# Altium schematic sheet Schematic.SchDoc
size 420 x 297 mm; SheetNumber: 1; SheetTotal: 1
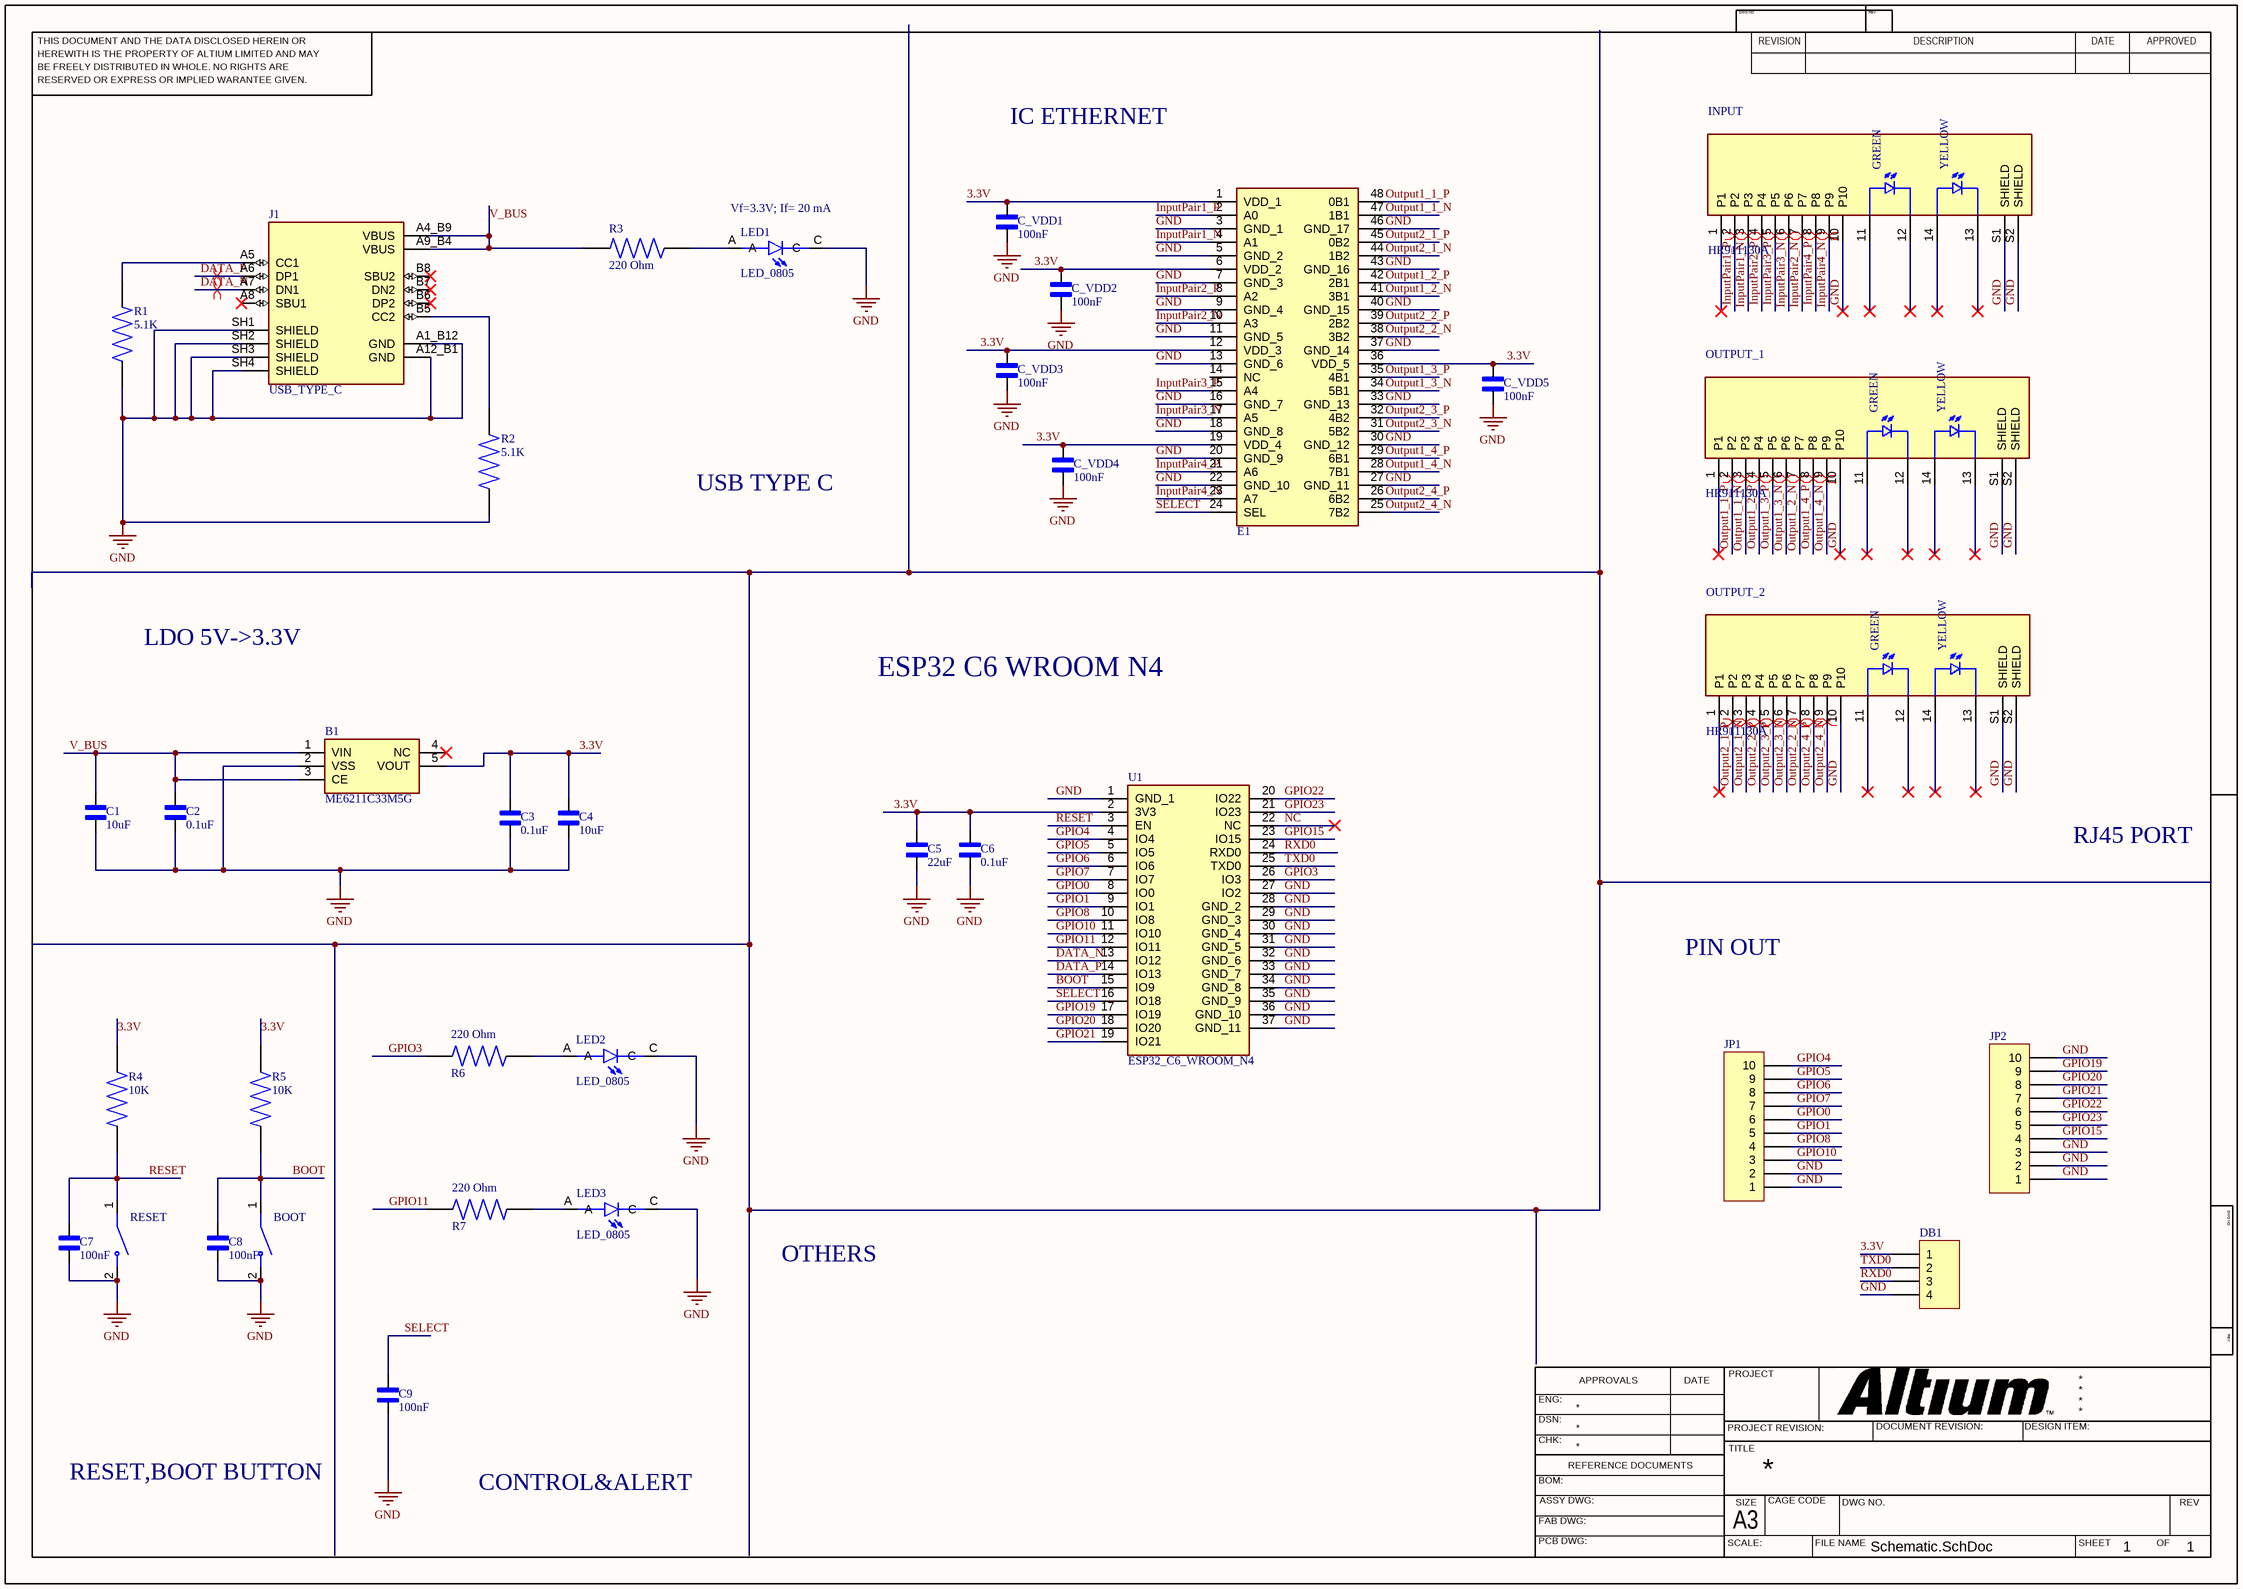
[diagram p0: Schematic.SchDoc]

## Parts
B1  ME6211C33M5G  [SOT95P282X145-5N]
BOOT  SW_B3U_P1000  [PCBComponent_1]  (value not drawn)
C1  10uF  [CAP 0.1UF_0805]
C2  0.1uF  [CAP 0.1UF_0805]
C3  0.1uF  [CAP 0.1UF_0805]
C4  10uF  [CAP 0.1UF_0805]
C5  22uF  [CAP 0.1UF_0805]
C6  0.1uF  [CAP 0.1UF_0805]
C7  100nF  [CAP 0.1UF_0805]
C8  100nF  [CAP 0.1UF_0805]
C9  100nF  [CAP 0.1UF_0805]
C_VDD1  100nF  [CAP 0.1UF_0805]
C_VDD2  100nF  [CAP 0.1UF_0805]
C_VDD3  100nF  [CAP 0.1UF_0805]
C_VDD4  100nF  [CAP 0.1UF_0805]
C_VDD5  100nF  [CAP 0.1UF_0805]
DB1  *Header  [HDR1X4]  (value not drawn)
E1  TS3L301  [TS3L301]  (value not drawn)
INPUT  HR911130A  [HR911130_A]
J1  USB_TYPE_C  [KINGHELM_KH-TYPE-C-16P]
JP1  *Header  [HDR1X10]  (value not drawn)
JP2  *Header  [HDR1X10]  (value not drawn)
LED1  LED_0805  [LED 0805]
LED2  LED_0805  [LED 0805]
LED3  LED_0805  [LED 0805]
OUTPUT_1  HR911130A  [HR911130_A]
OUTPUT_2  HR911130A  [HR911130_A]
R1  5.1K  [RES_10K_0805]
R2  5.1K  [RES_10K_0805]
R3  220 Ohm  [RES_10K_0805]
R4  10K  [RES_10K_0805]
R5  10K  [RES_10K_0805]
R6  220 Ohm  [RES_10K_0805]
R7  220 Ohm  [RES_10K_0805]
RESET  SW_B3U_P1000  [PCBComponent_1]  (value not drawn)
U1  ESP32_C6_WROOM_N4  [ESP32_C6_WROOM_N4]

## Nets
GND: B1.2(VSS) BOOT.2 C1.1 C2.1 C3.1 C4.1 C5.1 C6.1 C7.1 C8.1 C9.1 C_VDD1.1 C_VDD2.1 C_VDD3.1 C_VDD4.1 C_VDD5.1 DB1.4 E1.3(GND_1) E1.5(GND_2) E1.7(GND_3) E1.9(GND_4) E1.11(GND_5) E1.13(GND_6) E1.16(GND_7) E1.18(GND_8) E1.20(GND_9) E1.22(GND_10) E1.27(GND_11) E1.30(GND_12) E1.33(GND_13) E1.37(GND_14) E1.40(GND_15) E1.43(GND_16) E1.46(GND_17) INPUT.10(P10) INPUT.S1(SHIELD) INPUT.S2(SHIELD) J1.A1_B12(GND) J1.A12_B1(GND) J1.SH1(SHIELD) J1.SH2(SHIELD) J1.SH3(SHIELD) J1.SH4(SHIELD) JP1.1 JP1.2 JP2.1 JP2.2 JP2.3 JP2.10 LED1.C LED2.C LED3.C OUTPUT_1.10(P10) OUTPUT_1.S1(SHIELD) OUTPUT_1.S2(SHIELD) OUTPUT_2.10(P10) OUTPUT_2.S1(SHIELD) OUTPUT_2.S2(SHIELD) R1.2 R2.2 RESET.2 U1.1(GND_1) U1.27(IO2) U1.28(GND_2) U1.29(GND_3) U1.30(GND_4) U1.31(GND_5) U1.32(GND_6) U1.33(GND_7) U1.34(GND_8) U1.35(GND_9) U1.36(GND_10) U1.37(GND_11)
3.3V: B1.5(VOUT) C3.2 C4.2 C5.2 C6.2 C_VDD1.2 C_VDD2.2 C_VDD3.2 C_VDD4.2 C_VDD5.2 DB1.1 E1.1(VDD_1) E1.6(VDD_2) E1.12(VDD_3) E1.19(VDD_4) E1.36(VDD_5) R4.1 R5.1 U1.2(3V3)
BOOT: BOOT.1 C8.2 R5.2 U1.15(IO9)
DATA_N: J1.A7(DN1) U1.13(IO12)
DATA_P: J1.A6(DP1) U1.14(IO13)
GPIO0: JP1.6 U1.8(IO0)
GPIO1: JP1.5 U1.9(IO1)
GPIO3: R6.2 U1.26(IO3)
GPIO4: JP1.10 U1.4(IO4)
GPIO5: JP1.9 U1.5(IO5)
GPIO6: JP1.8 U1.6(IO6)
GPIO7: JP1.7 U1.7(IO7)
GPIO8: JP1.4 U1.10(IO8)
GPIO10: JP1.3 U1.11(IO10)
GPIO11: R7.2 U1.12(IO11)
GPIO15: JP2.4 U1.23(IO15)
GPIO19: JP2.9 U1.17(IO19)
GPIO20: JP2.8 U1.18(IO20)
GPIO21: JP2.7 U1.19(IO21)
GPIO22: JP2.6 U1.20(IO22)
GPIO23: JP2.5 U1.21(IO23)
InputPair1_N: E1.4(A1) INPUT.3(P3)
InputPair1_P: E1.2(A0) INPUT.2(P2)
InputPair2_N: E1.10(A3) INPUT.7(P7)
InputPair2_P: E1.8(A2) INPUT.4(P4)
InputPair3_N: E1.17(A5) INPUT.6(P6)
InputPair3_P: E1.15(A4) INPUT.5(P5)
InputPair4_N: E1.23(A7) INPUT.9(P9)
InputPair4_P: E1.21(A6) INPUT.8(P8)
NC: U1.22(NC)
Output1_1_N: E1.47(1B1) OUTPUT_1.3(P3)
Output1_1_P: E1.48(0B1) OUTPUT_1.2(P2)
Output1_2_N: E1.41(3B1) OUTPUT_1.7(P7)
Output1_2_P: E1.42(2B1) OUTPUT_1.4(P4)
Output1_3_N: E1.34(5B1) OUTPUT_1.6(P6)
Output1_3_P: E1.35(4B1) OUTPUT_1.5(P5)
Output1_4_N: E1.28(7B1) OUTPUT_1.9(P9)
Output1_4_P: E1.29(6B1) OUTPUT_1.8(P8)
Output2_1_N: E1.44(1B2) OUTPUT_2.3(P3)
Output2_1_P: E1.45(0B2) OUTPUT_2.2(P2)
Output2_2_N: E1.38(3B2) OUTPUT_2.7(P7)
Output2_2_P: E1.39(2B2) OUTPUT_2.4(P4)
Output2_3_N: E1.31(5B2) OUTPUT_2.6(P6)
Output2_3_P: E1.32(4B2) OUTPUT_2.5(P5)
Output2_4_N: E1.25(7B2) OUTPUT_2.9(P9)
Output2_4_P: E1.26(6B2) OUTPUT_2.8(P8)
RESET: C7.2 R4.2 RESET.1 U1.3(EN)
RXD0: DB1.3 U1.24(RXD0)
SELECT: C9.2 E1.24(SEL) U1.16(IO18)
TXD0: DB1.2 U1.25(TXD0)
V_BUS: B1.1(VIN) B1.3(CE) C1.2 C2.2 J1.A4_B9(VBUS) J1.A9_B4(VBUS) R3.2
NetJ1_A5: J1.A5(CC1) R1.1
NetJ1_B5: J1.B5(CC2) R2.1
NetLED1_A: LED1.A R3.1
NetLED2_A: LED2.A R6.1
NetLED3_A: LED3.A R7.1

Not connected (* = marked no-connect by the designer): B1 4(NC)*; E1 14(NC); INPUT 1(P1)* 11* 12* 13* 14*; J1 A8(SBU1)* B6(DP2)* B7(DN2)* B8(SBU2)*; OUTPUT_1 1(P1)* 11* 12* 13* 14*; OUTPUT_2 1(P1)* 11* 12* 13* 14*

## Layout directives
differential pair: DATA_N, DATA_P, InputPair1_N, InputPair1_P, InputPair2_N, InputPair2_P, InputPair3_N, InputPair3_P, InputPair4_N, InputPair4_P, Output1_1_N, Output1_1_P, Output1_2_N, Output1_2_P, Output1_3_N, Output1_3_P, Output1_4_N, Output1_4_P, Output2_1_N, Output2_1_P, Output2_2_N, Output2_2_P, Output2_3_N, Output2_3_P, Output2_4_N, Output2_4_P

## Notes on the sheet
- IC ETHERNET
- (near LED1) Vf=3.3V; If= 20 mA
- USB TYPE C
- LDO 5V->3.3V
- ESP32 C6 WROOM N4
- RJ45 PORT
- PIN OUT
- OTHERS
- RESET,BOOT BUTTON
- CONTROL&ALERT
- THIS DOCUMENT AND THE DATA DISCLOSED HEREIN OR
- HEREWITH IS THE PROPERTY OF ALTIUM LIMITED AND MAY
- DWG NO:
- REVISION
- REV:
- DESCRIPTION
- DATE
- APPROVED
- BE FREELY DISTRIBUTED IN WHOLE. NO RIGHTS ARE
- RESERVED OR EXPRESS OR IMPLIED WARANTEE GIVEN.
- ENG:
- APPROVALS
- PROJECT
- DSN:
- CHK:
- REFERENCE DOCUMENTS
- PROJECT REVISION:
- TITLE
- DOCUMENT REVISION:
- DESIGN ITEM:
- BOM:
- FAB DWG:
- PCB DWG:
- ASSY DWG:
- SCALE:
- A3
- SIZE
- CAGE CODE
- FILE NAME
- DWG NO.
- SHEET
- OF
- REV
- (in symbol HR911130A) GREEN; YELLOW

## Library data of the parts
B1 = ME6211C33M5G: High Speed LDO Regulators, High PSRR, Low noise, ME6211 Series; Manufacturer_Name: Microne; Geometry.Height: 1.45mm; Manufacturer_Part_Number: ME6211C33M5G; Mouser Part Number: *; Mouser Price/Stock: *; Arrow Part Number: *; Arrow Price/Stock: *; Datasheet Link: *
C1-C9 C_VDD1-C_VDD5 = CAP_0.1uF_0805
DB1 = Header 4: Header, 4-Pin, Right Angle; LatestRevisionDate: 17-Jul-2002; LatestRevisionNote: Re-released for DXP Platform.; Publisher: Altium Limited
J1 = KH-TYPE-C-16P: MF: kinghelm; SnapEDA_Link: https://www.snapeda.com/parts/KH-TYPE-C-16P/Kinghelm/view-part/?ref=snap; Package: None; Value: *; MP: KH-TYPE-C-16P; Check_prices: https://www.snapeda.com/parts/KH-TYPE-C-16P/Kinghelm/view-part/?ref=eda
JP1 JP2 = Header 10: Header, 10-Pin, Right Angle
R1-R7 = RES_10K_0805